# EAGLE schematic void (EAGLE 9.6.2)
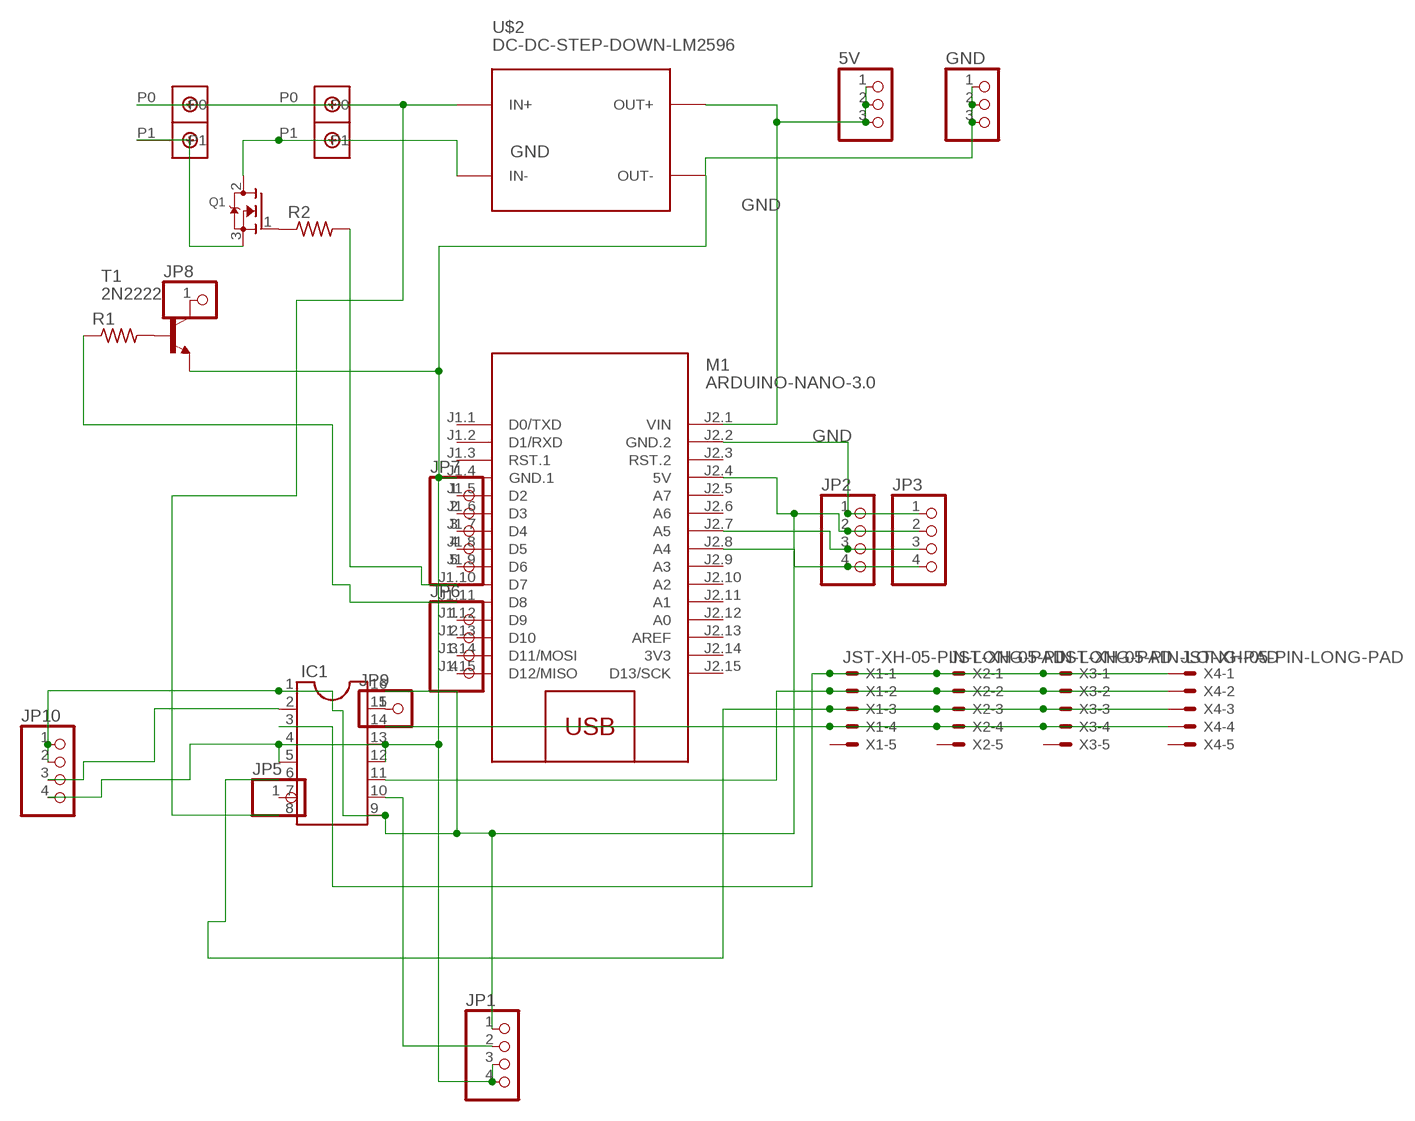
[diagram p0: schematic, sheet 1]

## Parts
5V  PINHD-1X3  [1X03]
GND  PINHD-1X3  [1X03]
IC1  DIL16S  [SOCKET-16]
JP1  PINHD-1X4  [1X04]
JP2  PINHD-1X4  [1X04]
JP3  PINHD-1X4  [1X04]
JP5  PINHD-1X1  [1X01]
JP6  PINHD-1X4  [1X04]
JP7  PINHD-1X5  [1X05]
JP8  PINHD-1X1  [1X01]
JP9  PINHD-1X1  [1X01]
JP10  PINHD-1X4  [1X04]
M1  ARDUINO-NANO-3.0  [ARDUINO-NANO-3.0]
POWER  DBCONN-1X2  [DBCONN-1X2]
PUMP  DBCONN-1X2  [DBCONN-1X2]
Q1  MOSFET-NGDS_TO220V  [TO220V]
R1  R-US_0204/5  [0204/5]
R2  R-US_0204/5  [0204/5]
T1  2N2222  [TO92-EBC-OVAL]
U$2  DC-DC-STEP-DOWN-LM2596  [DC-DC-STEP-DOWN-LM2596]
X1  JST-XH-05-PIN-LONG-PAD  [JST-XH-05-PACKAGE-LONG-PAD]
X2  JST-XH-05-PIN-LONG-PAD  [JST-XH-05-PACKAGE-LONG-PAD]
X3  JST-XH-05-PIN-LONG-PAD  [JST-XH-05-PACKAGE-LONG-PAD]
X4  JST-XH-05-PIN-LONG-PAD  [JST-XH-05-PACKAGE-LONG-PAD]

## Nets
GND: GND.1 GND.2 GND.3 IC1.4 IC1.5 IC1.12 IC1.13 JP1.3 JP1.4 JP2.1 JP3.1 JP10.4 M1.J1.4(GND.1) M1.J2.2(GND.2) POWER.P1 Q1.2(D) T1.E U$2.IN- U$2.OUT-
N$1: M1.J1.11(D8) R1.1
N$2: IC1.2 JP10.3
N$3: M1.J1.10(D7) R2.2
N$4: JP8.1 T1.C
N$5: R1.2 T1.B
N$6: Q1.1(G) R2.1
N$7: PUMP.P1 Q1.3(S)
N$8: 5V.1 5V.2 5V.3 M1.J2.1(VIN) U$2.OUT+
N$9: JP2.4 JP3.4 M1.J2.8(A4)
N$10: JP2.3 JP3.3 M1.J2.7(A5)
N$12: JP7.1 M1.J1.5(D2)
N$13: JP6.1 M1.J1.12(D9)
N$14: JP6.2 M1.J1.13(D10)
N$15: JP7.2 M1.J1.6(D3)
N$16: IC1.7 JP5.1
N$17: IC1.10 JP1.2
N$18: IC1.15 JP9.1
N$19: IC1.1 IC1.9 IC1.16 JP1.1 JP2.2 JP3.2 JP10.1 JP10.2 M1.J2.4(5V)
N$20: IC1.3 X1.1 X2.1 X3.1 X4.1
N$21: IC1.6 X1.3 X2.3 X3.3 X4.3
N$22: IC1.11 X1.2 X2.2 X3.2 X4.2
N$23: IC1.14 X1.4 X2.4 X3.4 X4.4
N$24: JP7.3 M1.J1.7(D4)
N$25: JP7.4 M1.J1.8(D5)
N$26: JP7.5 M1.J1.9(D6)
N$27: JP6.3 M1.J1.14(D11/MOSI)
N$28: JP6.4 M1.J1.15(D12/MISO)
PUMP: IC1.8 POWER.P0 PUMP.P0 U$2.IN+
Unconnected: M1.J1.1(D0/TXD) M1.J1.2(D1/RXD) M1.J1.3(RST.1) M1.J2.3(RST.2) M1.J2.5(A7) M1.J2.6(A6) M1.J2.9(A3) M1.J2.10(A2) M1.J2.11(A1) M1.J2.12(A0) M1.J2.13(AREF) M1.J2.15(D13/SCK) X1.5 X2.5 X3.5 X4.5

## Power pins joined to a net without a drawn wire
3V3: M1.J2.14(3V3)

## Library data of the parts
5V GND = adafruit:PINHD-1X3: PIN HEADER
IC1 = ic-package:DIL16: Dual In Line / Socket
JP1-JP3 JP6 JP10 = pinhead:PINHD-1X4: PIN HEADER
JP5 JP8 JP9 = adafruit:PINHD-1X1: Pin header 1x1 for 0.1" spacing With round pins
JP7 = pinhead:PINHD-1X5: PIN HEADER
M1 = diy-modules:ARDUINO-NANO-3.0: Arduino Nano 3.0
POWER PUMP = Terminal Block Connector:DBCONN-1X2
Q1 = adafruit:MOSFET-N: N-Channel Mosfet 2N7002E - 60V 260mA SOT23 [Digikey: 2N7002ET1GOSTR-ND] - REEL BSH103 - 30V 850mA SOT23 [Digikey: 568-5013-1-ND]
R1 R2 = adafruit:R-US_: RESISTOR, American symbol
T1 = adafruit:2N2222: NPN TRANSISTOR Big oval pads
U$2 = diy-modules:DC-DC-STEP-DOWN-LM2596: DC/DC Step-Down Regulator based on LM2596-ADJ chip
X1-X4 = Rembrandt Electronics - JST XH Connectors v1-0:JST-XH-05-PIN: JST XH Connector 2 Pin Wire to board connector. Pitch: 2,54 mm, (0.100") Number of pins: 5 Created by Rembrandt Electronics www.rembrandtelectronics.com